# EAGLE design Spark (EAGLE 7.2.0)
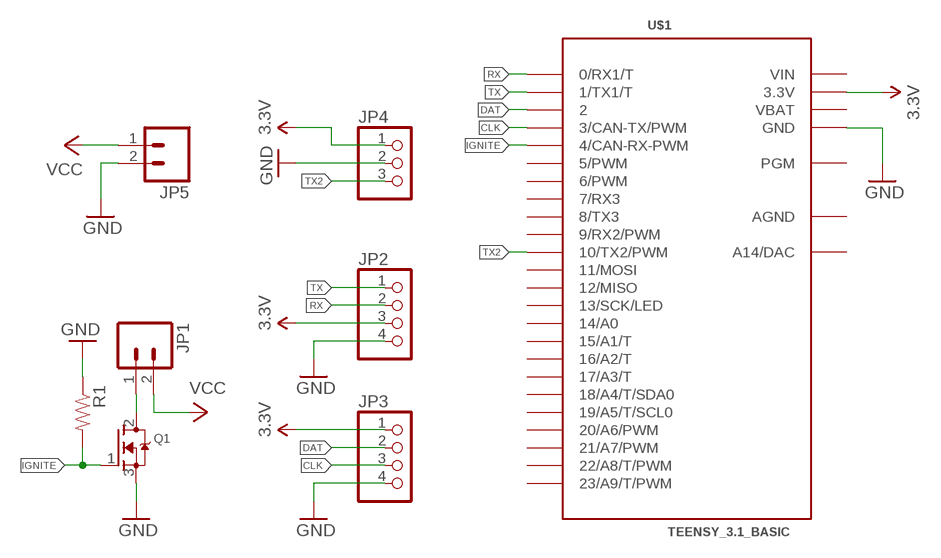
[diagram p0: schematic, sheet 1]

## Parts
JP1  M025MM  [SCREWTERMINAL-5MM-2]
JP2  PINHD-1X4  [1X04]
JP3  PINHD-1X4  [1X04]
JP4  PINHD-1X3  [1X03]
JP5  M025MM  [SCREWTERMINAL-5MM-2]
Q1  MOSFET-NGDS_TO220V  [TO220V]
R1  RESISTOREZ  [AXIAL-0.3EZ]
U$1  TEENSY_3.1_BASIC  [TEENSY_3.1_BASIC]

## Nets
3.3V: JP2.3 JP3.1 JP4.1 U$1.3.3V U$1.3.3V1(3.3V)
CLK: JP3.3 U$1.3(3/CAN-TX/PWM)
DAT: JP3.2 U$1.2
GND: JP2.4 JP3.4 JP4.2 JP5.2 Q1.3(S) R1.P$1 U$1.GND U$1.GND1(GND)
IGNITE: Q1.1(G) R1.P$2 U$1.4(4/CAN-RX-PWM)
N$2: JP1.1 Q1.2(D)
RX: JP2.2 U$1.0(0/RX1/T)
TX: JP2.1 U$1.1(1/TX1/T)
TX2: JP4.3 U$1.10(10/TX2/PWM)
VCC: JP1.2 JP5.1
Unconnected: U$1.5(5/PWM) U$1.6(6/PWM) U$1.7(7/RX3) U$1.8(8/TX3) U$1.9(9/RX2/PWM) U$1.11(11/MOSI) U$1.12(12/MISO) U$1.13(13/SCK/LED) U$1.14/A0 U$1.15/A1(15/A1/T) U$1.16/A2(16/A2/T) U$1.17/A3(17/A3/T) U$1.18/A4(18/A4/T/SDA0) U$1.19/A5(19/A5/T/SCL0) U$1.20/A6(20/A6/PWM) U$1.21/A7(21/A7/PWM) U$1.22/A8(22/A8/T/PWM) U$1.23/A9(23/A9/T/PWM) U$1.A14(A14/DAC) U$1.PGM

## Power pins joined to a net without a drawn wire
AGND: U$1.AGND
VBAT: U$1.VBAT
VIN: U$1.VIN

## Library data of the parts
JP1 JP5 = SparkFun-Connectors:M02: Standard 2-pin 0.1" header. Use with - straight break away headers ( PRT-00116) - right angle break away headers (PRT-00553) - swiss pins (PRT-00743) - machine pins (PRT-00117) - female headers (PRT-00115) Molex polarized connector foot print use with: PRT-08233 with associated crimp pins and housings. 2.54_SCREWTERM for use with PRT-10571. 3.5mm Screw Terminal footprints for PRT-08084 5mm Screw Terminal footprints for use with PRT-08432; STOREFRONT_ID: PRT-08432
JP2 JP3 = pinhead:PINHD-1X4: PIN HEADER
JP4 = pinhead:PINHD-1X3: PIN HEADER
Q1 = adafruit:MOSFET-N: N-Channel Mosfet 2N7002E - 60V 260mA SOT23 [Digikey: 2N7002ET1GOSTR-ND] - REEL BSH103 - 30V 850mA SOT23 [Digikey: 568-5013-1-ND]
R1 = SparkFun-Passives:RESISTOR: Resistor Basic schematic elements and footprints for 0603, 1206, and PTH resistors.
U$1 = Teensy_3_Series_Board_v1.0:TEENSY_3.1_BASIC: Footprint for Teensy 3.1 board using all pin connections on the outer perimeter

## Board
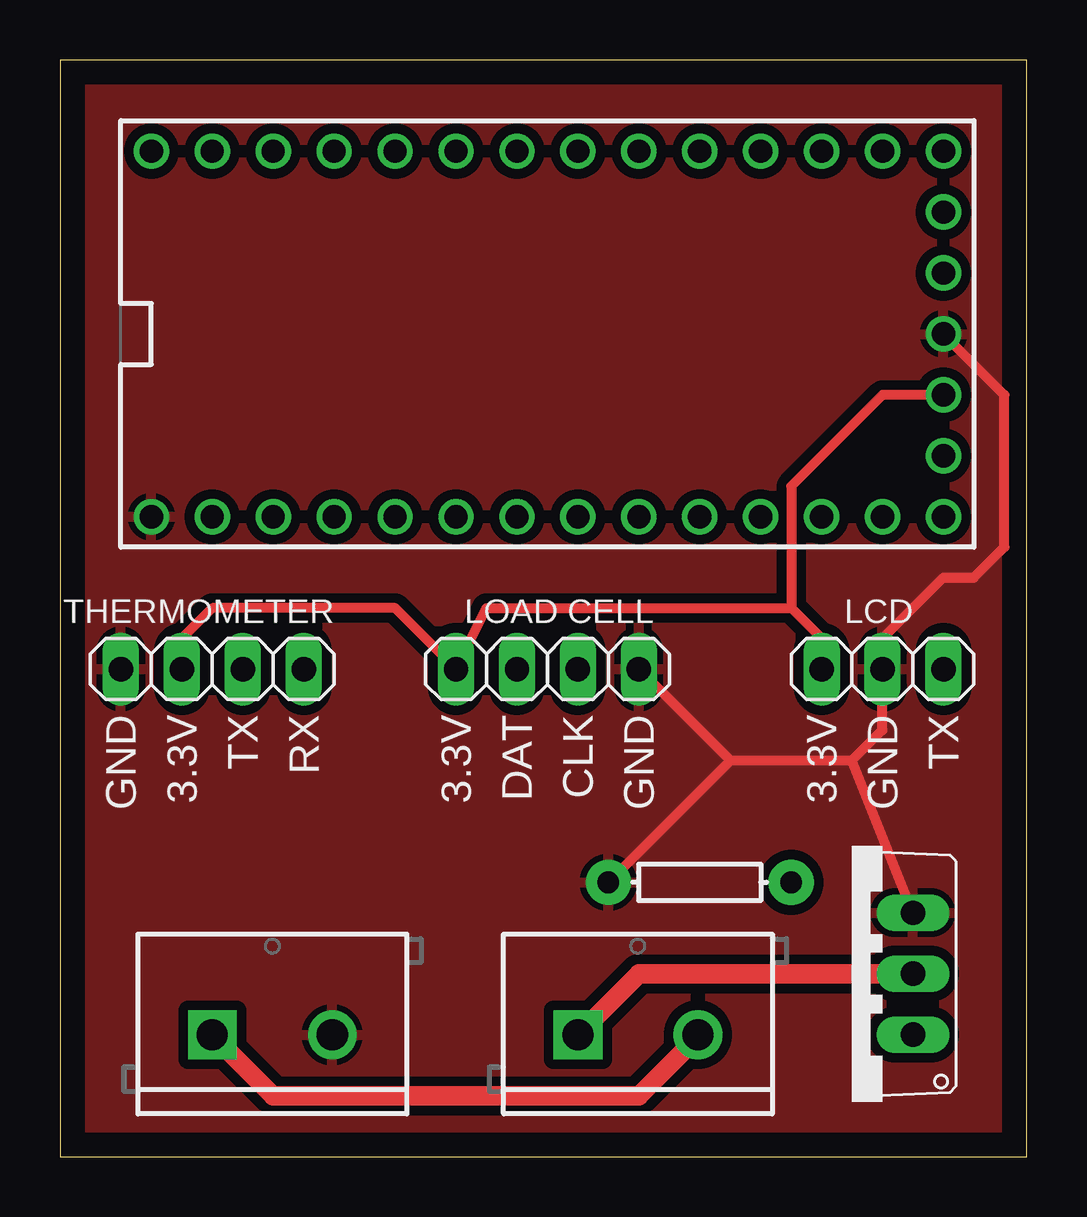
[diagram p1: board, top side]
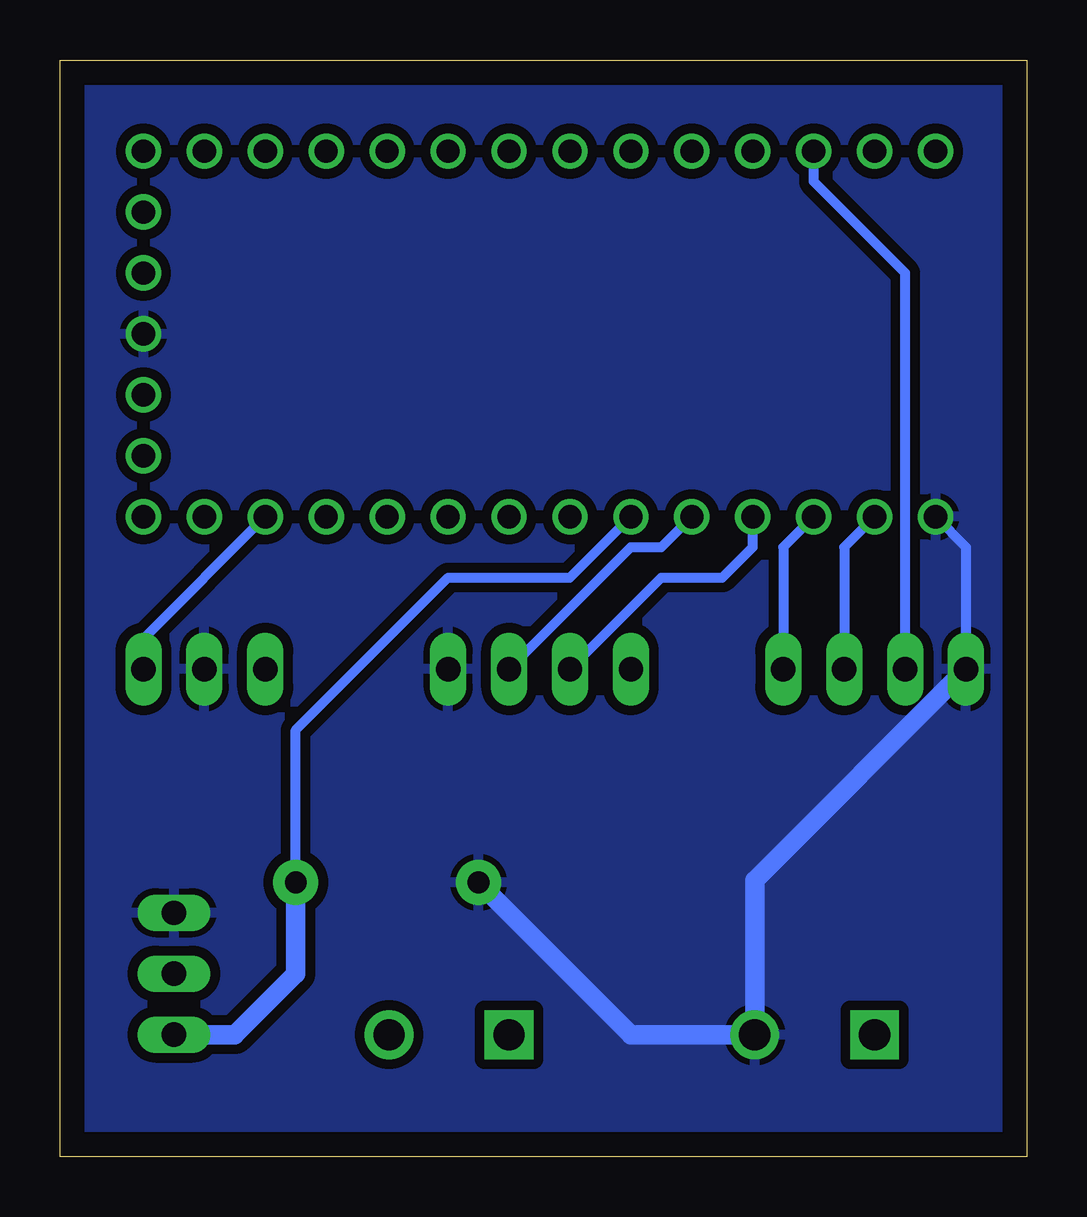
[diagram p2: board, bottom side, seen from below]

Size 40.31 x 45.71 mm. Coordinates in mm from the lower left corner, seen from the top.
Outline: 0,0 40.31,0 40.31,45.71 0,45.71 0,0
Copper layers (1*16): Top 0.035mm / dielectric 1.5mm / Bottom 0.035mm
Design rules "default": minimum track width 10mil, minimum drill 24mil, track to track 8mil, track to pad 8mil, pad to pad 8mil, via to via 8mil, smd to smd 8mil, copper to edge 40mil, drill to drill 8mil, minimum pad ring 10mil, minimum via ring 8mil, stop-mask expansion 4mil, vias tented up to drill 0mil, thermal gap 10mil

### Footprints (pad centres in the part's own frame; a part is rotated, then mirrored left to right if it is on the bottom)
SCREWTERMINAL-5MM-2 = drill 1.3 pad 2.032 square: 1 0,0 | drill 1.3 pad 2.032: 2 5,0
1X04 = drill 1.016 long: 1 -3.81,0; 2 -1.27,0; 3 1.27,0; 4 3.81,0
1X03 = drill 1.016 long: 1 -2.54,0; 2 0,0; 3 2.54,0
TO220V = drill 1.016 long: 1 -2.54,-2.54; 2 0,-2.54; 3 2.54,-2.54
AXIAL-0.3EZ = drill 0.9 pad 1.88: P$1 -3.81,0; P$2 3.81,0
TEENSY_3.1_BASIC = drill 0.965: 0 -7.62,13.97; 1 -7.62,11.43; 2 -7.62,8.89; 3 -7.62,6.35; 3.3V 7.62,11.43; 3.3V1 -2.54,-16.51; 4 -7.62,3.81; 5 -7.62,1.27; 6 -7.62,-1.27; 7 -7.62,-3.81; 8 -7.62,-6.35; 9 -7.62,-8.89; 10 -7.62,-11.43; 11 -7.62,-13.97; 12 -7.62,-16.51; 13 7.62,-16.51; 14/A0 7.62,-13.97; 15/A1 7.62,-11.43; 16/A2 7.62,-8.89; 17/A3 7.62,-6.35; 18/A4 7.62,-3.81; 19/A5 7.62,-1.27; 20/A6 7.62,1.27; 21/A7 7.62,3.81; 22/A8 7.62,6.35; 23/A9 7.62,8.89; A14 5.08,-16.51; AGND 7.62,13.97; GND -7.62,16.51; GND1 0,-16.51; PGM 2.54,-16.51; VBAT -5.08,-16.51; VIN 7.62,16.51

### Placement (x,y rotation side)
JP1  21.59,5.08 0 top
JP2  6.35,20.32 180 top
JP3  20.32,20.32 0 top
JP4  34.29,20.32 0 top
JP5  6.35,5.08 0 top
Q1  33.02,7.62 90 top
R1  26.67,11.43 0 top
U$1  20.32,34.29 90 top

### Tracks (layer width: path | path; a pad name or v marks a point on that pad's centre or on a via)
3.3V
  Top 0.406: JP2.3 5.08,21.59 6.35,22.86 13.97,22.86 JP3.1 17.78,22.86 30.48,22.86 | 30.48,22.86 31.75,21.59 JP4.1 | U$1.3.3V1 34.29,31.75 30.48,27.94 30.48,22.86
  Bottom 0.406: JP2.3 5.08,36.83 8.89,40.64 U$1.3.3V
CLK
  Bottom 0.406: JP3.3 16.51,25.4 15.24,25.4 U$1.3
DAT
  Bottom 0.406: JP3.2 15.24,24.13 12.7,24.13 11.43,25.4 U$1.2
GND
  Top 0.406: U$1.GND1 39.37,31.75 39.37,25.4 38.1,24.13 36.83,24.13 34.29,21.59 JP4.2 34.29,17.78 33.02,16.51 | Q1.3 33.02,16.51 | JP3.4 27.94,16.51 | 27.94,16.51 33.02,16.51 | R1.P$1 27.94,16.51
  Bottom 0.406: U$1.GND 2.54,25.4 JP2.4
  Bottom 0.813: R1.P$1 16.51,5.08 JP5.2 11.35,11.51 JP2.4
  pour Top (isolate 0.406): 0,46.99 41.91,46.99 41.91,-1.27 -1.27,-1.27 -1.27,46.99
  pour Bottom (isolate 0.406): -1.27,46.99 41.91,46.99 41.91,-1.27 -1.27,-1.27
IGNITE
  Bottom 0.406: R1.P$2 30.48,17.78 24.13,24.13 19.05,24.13 U$1.4
  Bottom 0.813: R1.P$2 30.48,7.62 33.02,5.08 Q1.1
N$2
  Top 0.813: JP1.1 24.13,7.62 Q1.2
RX
  Bottom 0.406: U$1.0 7.62,25.4 JP2.2
TX
  Bottom 0.406: U$1.1 10.16,25.4 JP2.1
TX2
  Bottom 0.406: JP4.3 36.83,21.59 U$1.10
VCC
  Top 0.813: JP5.1 8.89,2.54 24.13,2.54 26.59,5 JP1.2

### Text on the board
tNames: THERMOMETER | LOAD CELL | LCD | GND / 3.3V / TX / RX | 3.3V / DAT / CLK / GND | 3.3V / GND / TX
tValues: POWER | 10k | + - | IGN